# EAGLE design Croduino Nova v1.2 (EAGLE 7.3.0)

## Sheet 1 of 2
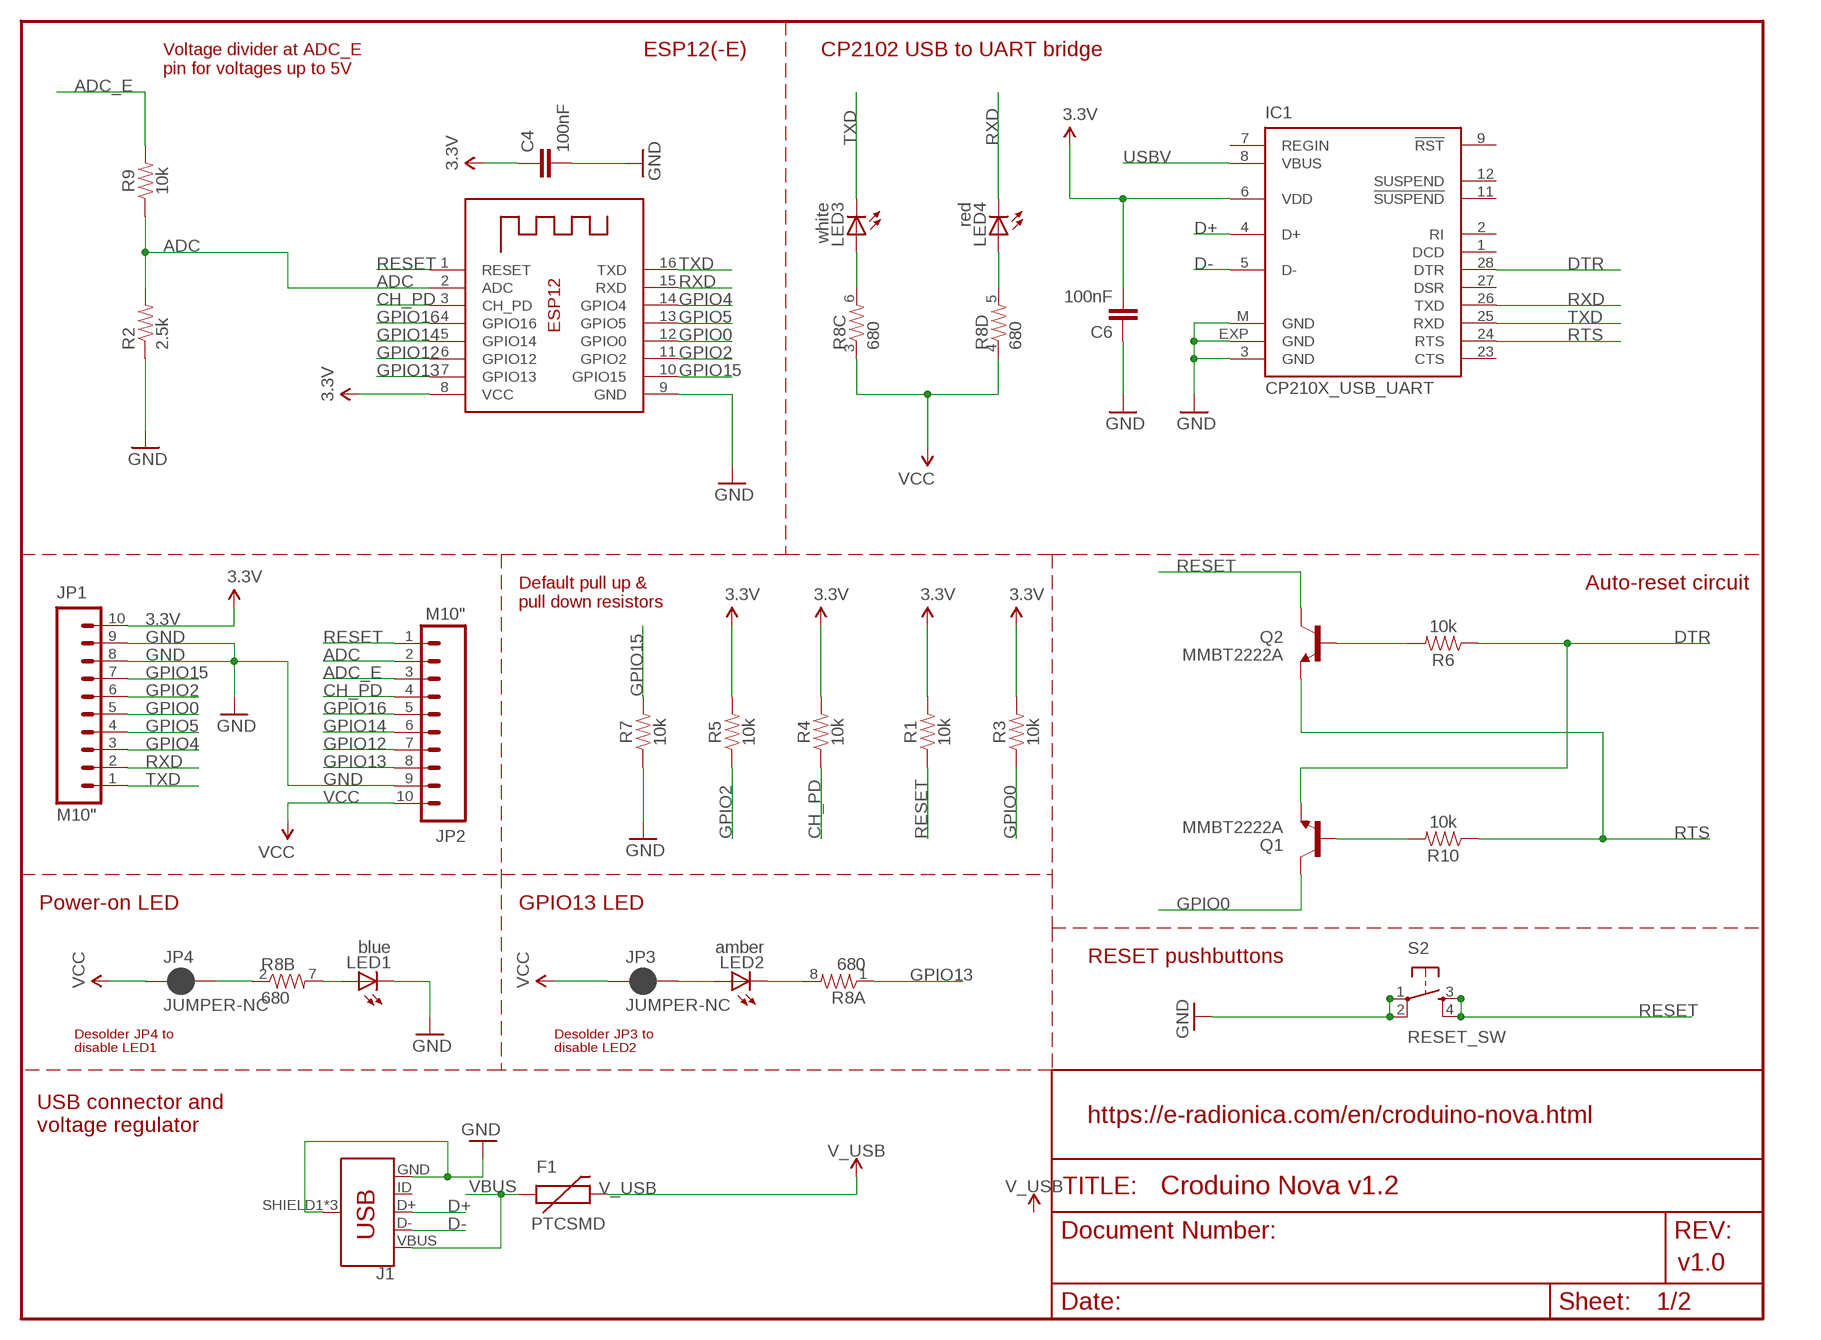
[diagram p0: schematic, sheet 1]

### Parts
C4  100nF  CAP0603-CAP  [0603-CAP]
C6  100nF  CAP0603-CAP  [0603-CAP]
F1  PTCSMD  [PTC-1206]
IC1  CP210X_USB_UART  [MLP28]
J1  USB_MICRO-BREDUCED_PASTE  [USB-B-MICRO-SMD_RED_PASTE]
JP1  M10"  [1X10]
JP2  M10"  [1X10]
JP3  JUMPER-NC  JUMPER-SMT_2_NC_PASTE_NO-SILK  [SMT-JUMPER_2_NC_PASTE_NO-SILK]
JP4  JUMPER-NC  JUMPER-SMT_2_NC_PASTE_NO-SILK  [SMT-JUMPER_2_NC_PASTE_NO-SILK]
LED1  blue  LEDCHIP-LED0805  [CHIP-LED0805]
LED2  amber  LEDCHIP-LED0805  [CHIP-LED0805]
LED3  white  LEDCHIP-LED0805  [CHIP-LED0805]
LED4  red  LEDCHIP-LED0805  [CHIP-LED0805]
Q1  MMBT2222A  TRANSISTOR_NPNSOT23-3  [SOT23-3]
Q2  MMBT2222A  TRANSISTOR_NPNSOT23-3  [SOT23-3]
R1  10k  10KOHM-0603-1/10W-1%  [0603]
R2  2.5k  RESISTOR0603-RES  [0603-RES]
R3  10k  10KOHM-0603-1/10W-1%  [0603]
R4  10k  10KOHM-0603-1/10W-1%  [0603]
R5  10k  10KOHM-0603-1/10W-1%  [0603]
R6  10k  10KOHM-0603-1/10W-1%  [0603]
R7  10k  10KOHM-0603-1/10W-1%  [0603]
R8  680  RESISTOR-ARRAY0603-ARV  [0603-ARV]
R9  10k  10KOHM-0603-1/10W-1%  [0603]
R10  10k  10KOHM-0603-1/10W-1%  [0603]
S2  RESET_SW  TAC_SWITCHSMD  [TACTILE_SWITCH_SMD]
X1  ESP8266-12  ESP-12  [ESP-12]

### Nets
3.3V: C4.1 C6.2 IC1.6(VDD) JP1.10 R1.2 R3.2 R4.2 R5.2 X1.8(VCC) ; also sheet 2
ADC: JP2.2 R2.2 R9.1 X1.2(ADC)
ADC_E: JP2.3 R9.2
CH_PD: JP2.4 R4.1 X1.3(CH_PD)
D+: IC1.4(D+) J1.D+
D-: IC1.5(D-) J1.D-
DTR: IC1.28(DTR) Q1.2(E) R6.1
GND: C4.2 C6.1 IC1.3(GND) IC1.EXP(GND) IC1.M(GND) J1.GND J1.SHIELD1(SHIELD) J1.SHIELD2(SHIELD) J1.SHIELD3(SHIELD) JP1.8 JP1.9 JP2.9 LED1.C R2.1 R7.1 S2.1 S2.2 X1.9(GND) ; also sheet 2
GPIO0: JP1.5 Q1.3(C) R3.1 X1.12(GPIO0)
GPIO2: JP1.6 R5.1 X1.11(GPIO2)
GPIO4: JP1.3 X1.14(GPIO4)
GPIO5: JP1.4 X1.13(GPIO5)
GPIO12: JP2.7 X1.6(GPIO12)
GPIO13: JP2.8 R8.1 X1.7(GPIO13)
GPIO14: JP2.6 X1.5(GPIO14)
GPIO15: JP1.7 R7.2 X1.10(GPIO15)
GPIO16: JP2.5 X1.4(GPIO16)
N$1: LED3.A R8.6
N$2: JP4.2 R8.2
N$3: LED1.A R8.7
N$4: LED4.A R8.5
N$5: LED2.C R8.8
N$6: JP3.2 LED2.A
N$8: Q1.1(B) R10.2
N$11: Q2.1(B) R6.2
RESET: JP2.1 Q2.3(C) R1.1 S2.3 S2.4 X1.1(RESET)
RTS: IC1.24(RTS) Q2.2(E) R10.1
RXD: IC1.26(TXD) JP1.2 LED4.C X1.15(RXD)
TXD: IC1.25(RXD) JP1.1 LED3.C X1.16(TXD)
USBV: IC1.8(VBUS)
V_USB: F1.2 ; also sheet 2
VBUS: F1.1 J1.VBUS
VCC: JP2.10 JP3.1 JP4.1 R8.3 R8.4 ; also sheet 2
Unconnected: IC1.1(DCD) IC1.2(RI) IC1.7(REGIN) IC1.9(!RST) IC1.11(!SUSPEND) IC1.12(SUSPEND) IC1.23(CTS) IC1.27(DSR) J1.ID

### Notes on the sheet
- ESP12(-E) | CP2102 USB to UART bridge
- Voltage divider at ADC_E
  pin for voltages up to 5V
- Auto-reset circuit
- Default pull up &
  pull down resistors
- Power-on LED | GPIO13 LED
- RESET pushbuttons
- Desolder JP4 to 
  disable LED1
- Desolder JP3 to
  disable LED2
- https://e-radionica.com/en/croduino-nova.html
- USB connector and 
  voltage regulator
- v1.0

## Sheet 2 of 2
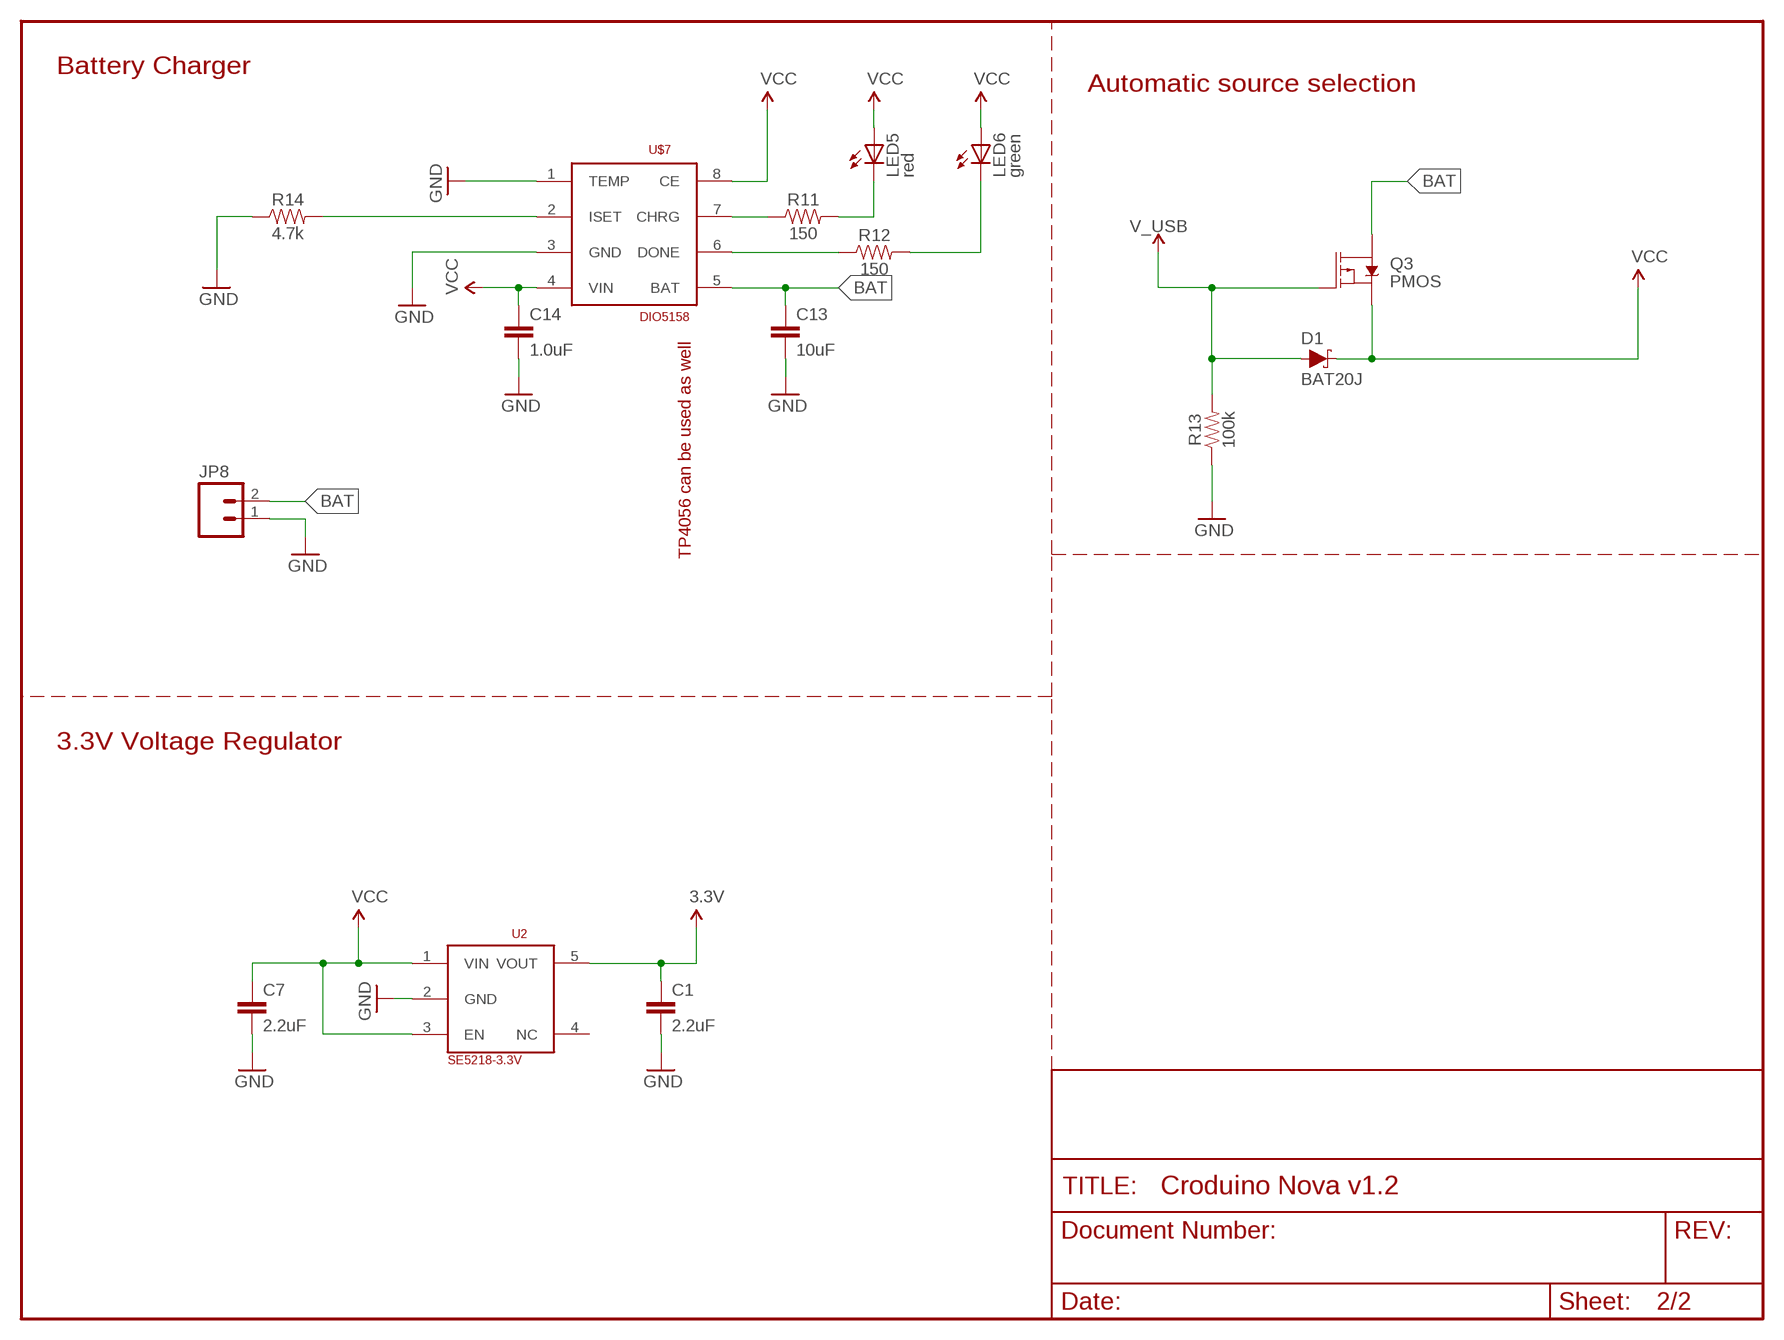
[diagram p1: schematic, sheet 2]

### Parts
C1  2.2uF  2.2UF-0603-10V-20%  [0603]
C7  2.2uF  2.2UF-0603-10V-20%  [0603]
C13  10uF  10UF-1206-6.3V-20%  [1206]
C14  1.0uF  1.0UF-0603-16V-10%  [0603]
D1  BAT20J  DIODE-SCHOTTKY-BAT20J  [SOD-323]
JP8  M02-JST-2MM-SMT  [JST-2-SMD]
LED5  red  LEDCHIP-LED0805  [CHIP-LED0805]
LED6  green  LEDCHIP-LED0805  [CHIP-LED0805]
Q3  PMOS  MOSFET_PCH-IRLML2244  [SOT23-3]
R11  150  150OHM-0603-1/10W-1%  [0603]
R12  150  150OHM-0603-1/10W-1%  [0603]
R13  100k  100KOHM-0603-1/10W-1%  [0603]
R14  4.7k  4.7KOHM-0603-1/10W-1%  [0603]
U2  SE5218-3.3V  SE5218  [SOT23-5]
U$7  DIO5158  [SOIC-8]

### Nets
3.3V: C1.1 U2.5(VOUT) ; also sheet 1
BAT: C13.1 JP8.2 Q3.3(D) U$7.5(BAT)
CHRG: R11.1 U$7.7(CHRG)
DONE: R12.1 U$7.6(DONE)
GND: C1.2 C7.2 C13.2 C14.2 JP8.1 R13.1 R14.1 U2.2(GND) U$7.1(TEMP) U$7.3(GND) ; also sheet 1
ISET: R14.2 U$7.2(ISET)
LED1: LED5.C R11.2
LED2: LED6.C R12.2
V_USB: D1.A Q3.1(G) R13.2 ; also sheet 1
VCC: C7.1 C14.1 D1.C LED5.A LED6.A Q3.2(S) U2.1(VIN) U2.3(EN) U$7.4(VIN) U$7.8(CE) ; also sheet 1
Unconnected: U2.4(NC)

### Notes on the sheet
- Battery Charger
- Automatic source selection
- TP4056 can be used as well
- 3.3V Voltage Regulator

## Library data of the parts
C1 C7 = SparkFun-Capacitors:2.2UF: 2.2µF ceramic capacitors A capacitor is a passive two-terminal electrical component used to store electrical energy temporarily in an electric field.; PROD_ID: CAP-07888
C4 C6 = SparkFun:CAP: Capacitor Standard 0603 ceramic capacitor, and 0.1" leaded capacitor.
C13 = SparkFun-Capacitors:10UF: 10.0µF ceramic capacitors A capacitor is a passive two-terminal electrical component used to store electrical energy temporarily in an electric field.; PROD_ID: CAP-10057
C14 = SparkFun-Capacitors:1.0UF: 1µF ceramic capacitors A capacitor is a passive two-terminal electrical component used to store electrical energy temporarily in an electric field.; PROD_ID: CAP-00868
D1 = SparkFun-DiscreteSemi:DIODE-SCHOTTKY: Schottky diode A Schottky diode is a semiconductor diode which has a low forward voltage drop and a very fast switching action.; PROD_ID: DIO-11623; VALUE: 1A/23V/620mV
F1 = SparkFun:PTC: Resettable Fuse PTC Resettable Fuse. Spark Fun Electronics SKU : COM-08357
IC1 = SparkFun:CP210X_USB_UART: Single-Chip USB to UART Bridge Source: www.silabs.com .. CP2101.pdf / cp2102.pdf. Spark Fun Electronics SKU : COM-00310
J1 = SparkFun-Connectors:USB_MICRO-B: USB Type Micro-B Connector Male/female and PTH/SMT variants SparkFun Products: SparkFun microB USB Breakout <https://www.sparkfun.com/products/12035> SparkFun USB microB Plug Breakout <https://www.sparkfun.com/products/10031> SparkFun ESP8266 Thing <https://www.sparkfun.com/products/13231>; PROD_ID: CONN-11752
JP1 JP2 = SparkFun:M10: Header 10 Standard 10-pin 0.1" header. Use with straight break away headers (SKU : PRT-00116), right angle break away headers (PRT-00553), swiss pins (PRT-00743), machine pins (PRT-00117), and female headers (PRT-00115).
JP3 JP4 = SparkFun-Jumpers:JUMPER-SMT_2_NC_PASTE: Normally closed solder jumper This jumper has an aperture in the stencil to allow solder paste to bridge the split in the wire so it's normally closed (NC). Wick off the solder to open the connection. Reapply solder to reclose the connection.
JP8 = SparkFun:M02: Header 2 Standard 2-pin 0.1" header. Use with straight break away headers (SKU : PRT-00116), right angle break away headers (PRT-00553), swiss pins (PRT-00743), machine pins (PRT-00117), and female headers (PRT-00115). Molex polarized connector foot print use with SKU : PRT-08233 with associated crimp pins and housings.
LED1-LED6 = adafruit:LED: LED OSRAM: - CHIPLED LG R971, LG N971, LY N971, LG Q971, LY Q971, LO R971, LY R971 LH N974, LH R974 LS Q976, LO Q976, LY Q976 LO Q996 - Hyper CHIPLED LW Q18S LB Q993, LB Q99A, LB R99A - SideLED LS A670, LO A670, LY A670, LG A670, LP A670 LB A673, LV A673, LT A673, LW A673 LH A674 LY A675 LS A676, LA A676, LO A676, LY A676, LW A676 LS A679, LY A679, LG A679 - Hyper Micro SIDELED® LS Y876, LA Y876, LO Y876, LY Y876 LT Y87S - SmartLED LW L88C, LW L88S LB L89C, LB L89S, LG L890 LS L89K, LO L89K, LY L89K LS L896, LA L896, LO L896, LY L896 - TOPLED LS T670, LO T670, LY T670, LG T670, LP T670 LSG T670, LSP T670, LSY T670, LOP T670, LYG T670 LG T671, LOG T671, LSG T671 LB T673, LV T673, LT T673, LW T673 LH T674 LS T676, LA T676, LO T676, LY T676, LB T676, LH T676, LSB T676, LW T676 LB T67C, LV T67C, LT T67C, LS T67K, LO T67K, LY T67K, LW E67C LS E67B, LA E67B, LO E67B, LY E67B, LB E67C, LV E67C, LT E67C LW T67C LS T679, LY T679, LG T679 LS T770, LO T770, LY T770, LG T770, LP T770 LB T773, LV T773, LT T773, LW T773 LH T774 LS E675, LA E675, LY E675, LS T675 LS T776, LA T776, LO T776, LY T776, LB T776 LHGB T686 LT T68C, LB T68C - Hyper Mini TOPLED® LB M676 - Mini TOPLED Santana® LG M470 LS M47K, LO M47K, LY M47K Source: http://www.osram.convergy.de/
Q1 Q2 = SparkFun:TRANSISTOR_NPN: Transistor NPN BJT configuration in SOT23 package. MMBT2222 is the common NPN we use. Double check BCE configuration again layout.
Q3 = SparkFun-DiscreteSemi:MOSFET_PCH: P-channel MOSFETs Voltage controlled devices that allow control of high current outputs. SparkFun Products: SparkFun ESP32 Thing <https://www.sparkfun.com/products/13907> SparkFun ESP8266 Thing <https://www.sparkfun.com/products/13231>; PROD_ID: TRANS-11153; VALUE: 4.3A/20V/54mΩ
R1 R3-R7 R9 R10 = SparkFun-Resistors:10KOHM: 10kΩ resistor A resistor is a passive two-terminal electrical component that implements electrical resistance as a circuit element. Resistors act to reduce current flow, and, at the same time, act to lower voltage levels within circuits. - Wikipedia; PROD_ID: RES-00824
R2 = SparkFun:RESISTOR: Resistor Basic schematic elements and footprints for 0603, 1206, and PTH resistors.
R8 = SparkFun:RESISTOR-ARRAY: Array Chip Resistor Source: RS Component / Phycomp
R11 R12 = SparkFun-Resistors:150OHM: 150Ω resistor A resistor is a passive two-terminal electrical component that implements electrical resistance as a circuit element. Resistors act to reduce current flow, and, at the same time, act to lower voltage levels within circuits. - Wikipedia; PROD_ID: RES-11028
R13 = SparkFun-Resistors:100KOHM: 100kΩ resistor A resistor is a passive two-terminal electrical component that implements electrical resistance as a circuit element. Resistors act to reduce current flow, and, at the same time, act to lower voltage levels within circuits. - Wikipedia; PROD_ID: RES-07828
R14 = SparkFun-Resistors:4.7KOHM: 4.7kΩ resistor A resistor is a passive two-terminal electrical component that implements electrical resistance as a circuit element. Resistors act to reduce current flow, and, at the same time, act to lower voltage levels within circuits. - Wikipedia; PROD_ID: RES-07857
S2 = SparkFun:TAC_SWITCH: Momentary Switch Button commonly used for reset or general input. Spark Fun Electronics SKU : COM-00097
U2 = ERADIONICA:SE5218
U$7 = ERADIONICA:DIO5158
X1 = adafruit:ESP-12

## Board
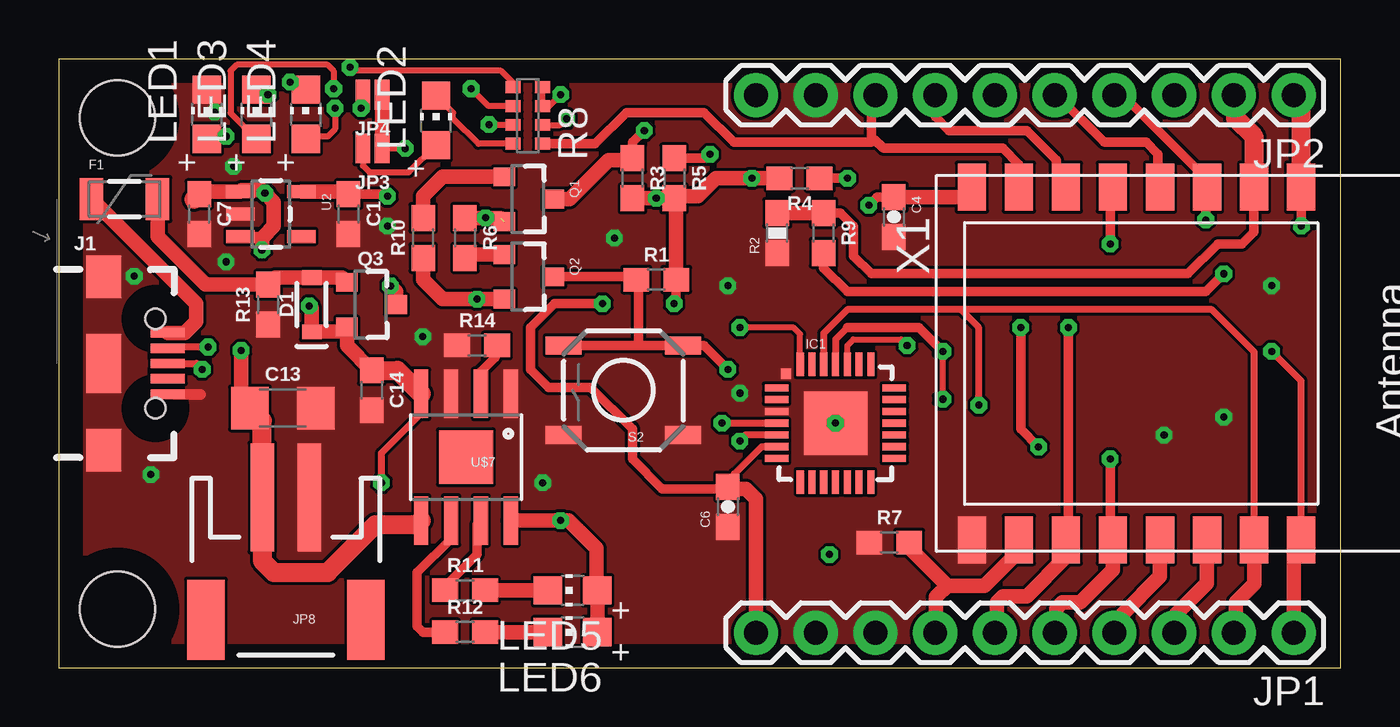
[diagram p2: board, top side]
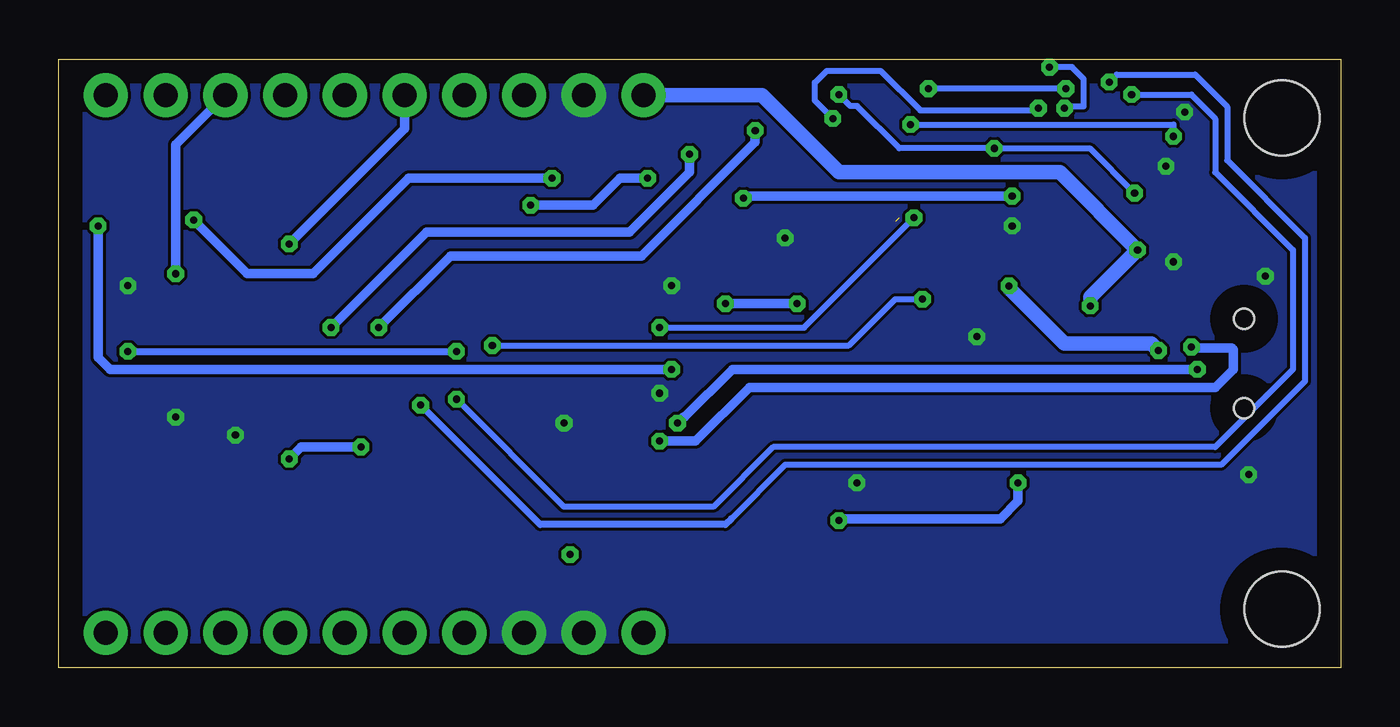
[diagram p3: board, bottom side, seen from below]

Size 54.5 x 25.9 mm. Coordinates in mm from the lower left corner, seen from the top.
Outline: 0,0 54.5,0 54.5,25.9 0,25.9 0,0
Copper layers (1*16): Top 0.035mm / dielectric 1.5mm / Bottom 0.035mm
Design rules "default *": minimum track width 10mil, minimum drill 24mil, track to track 5mil, track to pad 5mil, pad to pad 5mil, via to via 5mil, smd to smd 0mil, copper to edge 40mil, drill to drill 8mil, minimum pad ring 10mil, minimum via ring 8mil, stop-mask expansion 4mil, vias tented up to drill 0.6mm, thermal gap 10mil
Holes 3.2 mm at 2.5,23.4 2.5,2.5

### Footprints (pad centres in the part's own frame; a part is rotated, then mirrored left to right if it is on the bottom)
0603 = smd 1.1 x 1: 1 -0.85,0; 2 0.85,0
0603-CAP = smd 1.1 x 1: 1 -0.85,0; 2 0.85,0
1206 = smd 1.6 x 1.8: 1 -1.4,0; 2 1.4,0
SOD-323 = smd 0.63 x 0.83: A 1.15,0; C -1.15,0
PTC-1206 = smd 1 x 1.8: 1 -1.4,0; 2 1.4,0
MLP28 = smd 1 x 0.3: 1 -2.5,1.5; 2 -2.5,1; 3 -2.5,0.5; 4 -2.5,0; 5 -2.5,-0.5; 6 -2.5,-1; 7 -2.5,-1.5; 15 2.5,-1.5; 16 2.5,-1; 17 2.5,-0.5; 18 2.5,0; 19 2.5,0.5; 20 2.5,1; 21 2.5,1.5 | smd 0.3 x 1: 8 -1.5,-2.5; 9 -1,-2.5; 10 -0.5,-2.5; 11 0,-2.5; 12 0.5,-2.5; 13 1,-2.5; 14 1.5,-2.5; 22 1.5,2.5; 23 1,2.5; 24 0.5,2.5; 25 0,2.5; 26 -0.5,2.5; 27 -1,2.5; 28 -1.5,2.5 | smd 2.7 x 2.7: EXP 0,0 | smd 0.435 x 0.435: M -2.103,2.103
USB-B-MICRO-SMD_RED_PASTE = smd 1.45 x 0.4: D+ 2.725,0; D- 2.725,0.65; GND 2.725,-1.3; ID 2.725,-0.65; VBUS 2.725,1.3 | smd 1.5 x 1.8: SHIELD1 0,3.685; SHIELD2 0,-3.685 | smd 1.5 x 2.5: SHIELD3 0,0 | hole 0.85: 2.2,1.9; 2.2,-1.9
1X10 = drill 1.016 pad 1.88: 1 0,0; 2 2.54,0; 3 5.08,0; 4 7.62,0; 5 10.16,0; 6 12.7,0; 7 15.24,0; 8 17.78,0; 9 20.32,0; 10 22.86,0
SMT-JUMPER_2_NC_PASTE_NO-SILK = smd 0.635 x 1.27: 1 -0.406,0; 2 0.406,0
JST-2-SMD = smd 1 x 4.6: 1 -1,-3.7; 2 1,-3.7 | smd 1.6 x 3.4: NC1 -3.4,1.5; NC2 3.4,1.5
CHIP-LED0805 = smd 1.2 x 1.2: A 0,-1.05; C 0,1.05
SOT23-3 = smd 0.8 x 0.9: 1 -0.95,-1; 2 0.95,-1; 3 0,1.1
0603-RES = smd 1.1 x 1: 1 -0.85,0; 2 0.85,0
0603-ARV = smd 0.5 x 0.65: 1 -1.2,-0.625; 2 -0.4,-0.625; 3 0.4,-0.625; 4 1.2,-0.625; 5 1.2,0.625; 6 0.4,0.625; 7 -0.4,0.625; 8 -1.2,0.625
TACTILE_SWITCH_SMD = smd 1.524 x 0.762: 1 -2.54,1.905; 2 2.54,1.905; 3 -2.54,-1.905; 4 2.54,-1.905
SOT23-5 = smd 0.55 x 1.2: 1 -0.95,-1.3; 2 0,-1.3; 3 0.95,-1.3; 4 0.95,1.3; 5 -0.95,1.3
SOIC-8 = smd 0.61 x 2.057: 1 -2.07,-2.892; 2 -0.8,-2.892; 3 0.47,-2.892; 4 1.74,-2.892; 5 1.74,2.492; 6 0.47,2.492; 7 -0.8,2.492; 8 -2.07,2.492 | smd 2.286 x 2.286: EPAD -0.165,-0.2
ESP-12 = smd 2 x 1.2: 1 -7.5,4.5; 2 -7.5,2.5; 3 -7.5,0.5; 4 -7.5,-1.5; 5 -7.5,-3.5; 6 -7.5,-5.5; 7 -7.5,-7.5; 8 -7.5,-9.5; 9 7.5,-9.5; 10 7.5,-7.5; 11 7.5,-5.5; 12 7.5,-3.5; 13 7.5,-1.5; 14 7.5,0.5; 15 7.5,2.5; 16 7.5,4.5

### Placement (x,y rotation side)
C1  12.32,19.3 270 top
C4  35.5,19.18 270 top
C6  28.45,6.86 90 top
C7  5.97,19.3 270 top
C13  9.53,11.05 0 top
C14  13.3,11.81 270 top
D1  10.75,15.45 90 top
F1  2.79,19.94 0 top
IC1  33.02,10.41 0 top
J1  1.91,12.95 0 top
JP1  52.5,1.5 180 top
JP2  52.5,24.36 180 top
JP3  13.34,22.1 180 top
JP4  13.34,24.38 180 top
JP8  9.65,3.56 180 top
LED1  6.3,23.55 0 top
LED2  16.04,23.29 0 top
LED3  8.4,23.55 0 top
LED4  10.5,23.55 0 top
LED5  21.84,3.3 90 top
LED6  21.84,1.52 90 top
Q1  19.94,19.94 270 top
Q2  19.94,16.64 270 top
Q3  13.25,15.45 270 top
R1  25.4,16.51 0 top
R2  30.54,18.5 90 top
R3  24.38,20.83 270 top
R4  31.5,20.83 180 top
R5  26.16,20.83 270 top
R6  17.27,18.29 270 top
R7  35.31,5.33 0 top
R8  19.94,23.5 90 top
R9  32.51,18.5 270 top
R10  15.49,18.29 90 top
R11  17.27,3.3 0 top
R12  17.27,1.52 0 top
R13  8.9,15.45 90 top
R14  17.78,13.72 0 top
S2  24,11.81 180 top
U2  9.02,19.3 270 top
U$1  [LOGO-3MM]  22.61,5.94 0 top
U$2  [CRODUINO_NOVA]  4.06,1.02 0 top
U$3  [OSH-3MM]  1.09,4.88 0 top
U$4  [E-R.IO-6MM]  21.27,4.25 0 top
U$5  [MADE-IN-CROATIA-10MM]  38.61,7.11 0 top
U$6  [E-R.IO-BACK-6MM]  0.85,16.25 270 top
U$7  17.14,8.76 180 top
X1  48.32,12.95 270 top

### Tracks (layer width: path | path; a pad name or v marks a point on that pad's centre or on a via)
3.3V  (via drill 0.3)
  Top 0.305: IC1.6 29.88,9.41 28.73,8.25 28.73,7.99 C6.2
  Top 0.406: C1.1 13.88,20.15 v13.97,20.07 | C4.1 34.79,20.03 v34.44,19.68 | R1.2 26.25,15.58 v26.16,15.49 | v23.11,15.49 21.08,15.49 20.07,14.48 20.07,12.7 20.83,11.94 22.61,11.94 24.38,10.16 24.38,8.89 25.65,7.62 28.36,7.62 C6.2
  Top 0.61: U2.5 12.22,20.25 C1.1 | R3.2 v25.4,19.98 R5.2 | R1.2 26.25,19.89 R5.2 | R4.2 v29.46,20.83 27.94,20.83 27.18,20.07 26.25,20.07 R5.2 | C4.1 38.4,20.03 X1.8 | JP1.10 29.64,7.19 29.21,7.62 28.54,7.62 C6.2
  Bottom 0.406: v13.97,20.07 25.31,20.07 v25.4,19.98 | v34.44,19.68 31.8,19.68 R4.2 v29.46,20.83 | v26.16,15.49 v23.11,15.49
ADC
  Top 0.406: R9.1 33.23,19.35 33.78,18.8 33.78,17.53 34.54,16.76 48.01,16.76 49.28,18.03 50.29,18.03 50.8,18.54 50.8,20.43 X1.2
  Top 0.61: R2.2 R9.1
  Top 0.813: X1.2 50.82,22.59 50.04,23.37 50.04,24.28 JP2.2
ADC_E  (via drill 0.3)
  Top 0.406: R9.2 32.51,17.02 33.53,16 48.77,16 v49.53,16.76
  Bottom 0.406: v49.53,16.76 49.53,22.25 JP2.3
BAT  (via drill 0.3)
  Top 0.61: Q3.3 14.35,16 v14.1,16.25 | v7.75,13.5 7.75,11.42 C13.1
  Top 0.813: 7.75,11.42 C13.1 8.65,10.52 JP8.2 8.65,4.56 9.14,4.06 11.43,4.06 13.46,6.1 15.23,6.1 U$7.5
  Bottom 0.61: v14.1,16.25 14.1,16.15 11.75,13.8 8.05,13.8 v7.75,13.5
CH_PD  (via drill 0.3)
  Top 0.406: JP2.4 45.24,24.36 48.51,21.08 48.51,20.75 X1.3 48.77,20.4 v48.77,19.05 | R4.1 v33.53,20.83
  Bottom 0.406: v33.53,20.83 39.62,20.83 43.69,16.76 46.48,16.76 v48.77,19.05
CHRG
  Top 0.406: R11.1 16.42,3.47 17.78,4.83 17.78,6.11 U$7.7
D+  (via drill 0.3)
  Top 0.305: J1.D+ 5.85,12.95 v6.1,12.7 | v28.19,10.41 IC1.4
  Bottom 0.305: 27.94,10.67 v28.19,10.41
  Bottom 0.406: 27.94,10.67 27.9,10.67 25.87,12.7 v6.1,12.7
D-  (via drill 0.3)
  Top 0.305: IC1.5 29.21,9.91 v28.96,9.65 | v6.35,13.65 4.68,13.65 J1.D-
  Bottom 0.305: 5.33,13.65 v6.35,13.65
  Bottom 0.406: v28.96,9.65 27.43,9.65 25.15,11.94 5.33,11.94 4.57,12.7 4.57,13.54 J1.D- 6.3,13.6 v6.35,13.65
DONE
  Top 0.406: U$7.6 16.68,5.5 15.24,4.06 15.24,1.78 15.49,1.52 R12.1
DTR  (via drill 0.3)  (1 unrouted)
  Top 0.254: IC1.28 31.52,14.2 31.24,14.48 v28.96,14.48 | v18.14,19.15 17.93,18.99 17.78,19.14
  Top 0.61: R6.1 17.78,19.14 18.79,19.14 v18.14,19.15
  Bottom 0.254: v28.96,14.48 22.82,14.48 v18.14,19.15
GND  (via drill 0.3)
  Top 0.254: 4.92,11.64 J1.GND
  Top 0.45: 6.03,11.64 4.92,11.64
  other vias: 15.47,14.09 3.21,16.66 20.57,7.87 46.99,9.91 49.53,10.67 51.56,16.26 28.45,16.26 23.62,18.29 13.97,18.8 33.02,10.41 28.96,11.68 7.11,17.27 7.43,21.34 6.63,23.65 3.91,8.22
  pour Bottom (no thermals): 0,0 54.5,0 53.5,25.9 0,25.9
  pour Top (no thermals): 0,0 54.5,0 54.5,25.9 0,25.9
GPIO0  (via drill 0.3)
  Top 0.406: R3.1 24.38,22.35 v24.89,22.86 | v40.89,14.48 40.89,10.16 v41.66,9.4 | v44.7,8.89 44.7,5.56 X1.12
  Top 0.61: X1.12 44.82,4.18 43.43,2.79 42.67,2.79 42.42,2.54 42.42,1.58 JP1.5 | Q1.3 21.72,19.94 23.37,21.59 24.3,21.59 R3.1
  Bottom 0.406: v24.89,22.86 24.89,22.35 29.72,17.53 37.85,17.53 v40.89,14.48 | v41.66,9.4 44.2,9.4 v44.7,8.89
GPIO2  (via drill 0.3)
  Top 0.406: R5.1 27.52,21.68 v27.69,21.84 | v42.93,14.48 42.93,5.56 X1.11
  Top 0.61: X1.11 42.82,4.72 41.15,3.05 40.13,3.05 39.88,2.79 39.88,1.58 JP1.6
  Bottom 0.406: v27.69,21.84 27.69,21.08 30.23,18.54 38.86,18.54 v42.93,14.48
GPIO4
  Top 0.61: X1.14 48.82,3.61 47.5,2.29 47.5,1.58 JP1.3
GPIO5
  Top 0.61: X1.13 46.82,3.89 45.21,2.29 45.21,1.83 JP1.4
GPIO12
  Top 0.406: JP2.7 37.26,23.45 37.85,22.86 41.15,22.86 42.42,21.59 42.42,20.85 X1.6
GPIO13
  Top 0.406: X1.7 40.82,21.41 40.13,22.1 35.05,22.1 34.67,22.48 | 34.67,22.48 34.54,22.61 34.54,24.18 JP2.8 | R8.1 22.8,22.3 24.13,23.62 27.43,23.62 28.7,22.35 34.54,22.35 34.67,22.48
GPIO14  (via drill 0.3)
  Top 0.406: v44.7,18.03 44.7,20.34 X1.5
  Bottom 0.406: JP2.6 39.8,22.94 v44.7,18.03
GPIO15
  Top 0.61: X1.10 40.82,4.95 39.36,3.49 37.77,3.49 | 37.77,3.49 37.29,3.02 37.29,1.53 JP1.7 | R7.2 36.16,5.11 37.77,3.49
GPIO16
  Top 0.406: JP2.5 42.44,24.36 44.45,22.35 46.23,22.35 46.74,21.84 46.74,20.53 X1.4
ISET
  Top 0.406: U$7.2 17.95,12.61 18.54,13.21 18.54,13.63 R14.2
LED1
  Top 0.61: LED5.C R11.2
LED2
  Top 0.61: R12.2 LED6.C
N$1  (via drill 0.3)
  Top 0.254: R8.6 18.27,23.89 v17.53,24.64 | v11.68,24.64 11.68,25.4 11.43,25.65 7.56,25.65 7.3,25.39 7.3,23.6 LED3.A
  Bottom 0.254: v11.68,24.64 v17.53,24.64
N$2  (via drill 0.3)
  Top 0.254: R8.2 21.32,23.09 v21.59,23.37 | v12.86,23.8 12.86,24.31 JP4.2
  Bottom 0.254: v21.59,23.37 22.35,24.13 22.35,24.89 21.84,25.4 19.56,25.4 17.88,23.72 12.93,23.72 v12.86,23.8
N$3  (via drill 0.3)
  Top 0.254: R8.7 18.31,23.09 v18.29,23.11 | 6.19,22.61 LED1.A 6.41,22.61 v7.11,22.61
  Bottom 0.254: v18.29,23.11 7.11,23.11 v7.11,22.61
N$4  (via drill 0.3)
  Top 0.254: R8.5 19.31,24.88 18.8,25.4 12.53,25.4 v12.38,25.55 | v11.74,23.8 11.74,22.92 11.43,22.61 10.61,22.61 LED4.A
  Bottom 0.254: v12.38,25.55 11.43,25.55 10.92,25.05 10.92,23.88 11.67,23.88 v11.74,23.8
N$5
  Top 0.254: R8.8 17.84,22.3 16.76,23.37 16.76,23.61 LED2.C
N$6
  Top 0.254: JP3.2 12.93,21.36 13.21,21.08 14.88,21.08 LED2.A
N$8
  Top 0.61: Q1.1 16.32,20.89 15.49,20.07 R10.2
N$11
  Top 0.61: Q2.1 17.42,17.59 R6.2
N$14  (via drill 0.3)
  other vias: 32.77,4.83
RESET  (via drill 0.3)
  Top 0.406: S2.4 24.64,13.72 | 24.64,13.72 S2.3 27.43,13.72 v28.45,12.7 | R1.1 24.42,16.64 Q2.3 24.51,16.64 24.64,16.51 24.64,13.72 | v52.83,18.8 52.83,20.44 X1.1
  Top 0.813: X1.1 52.82,24.04 JP2.1
  Bottom 0.406: v28.45,12.7 52.32,12.7 52.83,13.21 v52.83,18.8
RTS  (via drill 0.3)
  Top 0.254: IC1.24 33.52,13.71 33.78,13.97 35.81,13.97 v36.07,13.72
  Top 0.61: Q2.2 v17.78,15.69 16.32,15.69 16.13,15.88 15.49,16.51 R10.1
  Bottom 0.254: v36.07,13.72 20.91,13.72 Q2.2 v17.78,15.69
RXD  (via drill 0.3)
  Top 0.254: LED4.C 10.16,24.6 v9.84,24.92
  Top 0.305: X1.15 50.82,13.44 49.02,15.24 38.35,15.24 | 38.35,15.24 33.53,15.24 32.51,14.22 IC1.26 | v39.12,11.18 39.12,14.48 38.35,15.24
  Top 0.61: X1.15 50.82,3.57 50.04,2.79 50.04,1.58 JP1.2
  Bottom 0.254: v9.84,24.92 9.52,25.23 6.18,25.23 4.83,23.88 4.83,21.59 1.52,18.29 1.52,12.19 5.08,8.64 23.62,8.64 25.91,6.35
  Bottom 0.305: 25.91,6.35 26.16,6.1 34.04,6.1 v39.12,11.18
TXD  (via drill 0.3)
  Top 0.254: LED3.C 8.93,24.6 v8.89,24.38 | v37.59,11.43 v37.59,13.46
  Top 0.305: X1.16 52.82,12.21 v51.56,13.46 | IC1.25 33.02,13.97 33.53,14.48
  Top 0.406: 33.53,14.48 36.58,14.48 v37.59,13.46
  Top 0.61: JP1.1 52.5,5.13 X1.16
  Bottom 0.254: v8.89,24.38 6.35,24.38 5.33,23.37 5.33,21.08 2.03,17.78 2.03,12.7 5.33,9.4 24.13,9.4 26.67,6.86 33.02,6.86 v37.59,11.43
  Bottom 0.305: v51.56,13.46 v37.59,13.46
V_USB
  Top 0.61: Q3.1 12.05,16.6 D1.A 9.2,16.6 R13.2 6.25,16.3 4.19,18.36 F1.2
VBUS
  Top 0.61: J1.VBUS 5.36,14.25 5.84,14.73 5.84,15.49 F1.1
VCC  (via drill 0.3)
  Top 0.254: R8.4 R8.3 20.58,23.88 20.83,23.88 v21.34,24.38 | JP3.1 v14.73,22.1
  Top 0.305: v13.72,7.87 13.72,9.14 15.4,10.83
  Top 0.406: U2.3 8.7,18.35 | 7.78,20.32 U2.1 | U$7.4 15.4,10.83
  Top 0.61: LED6.A LED5.A 22.86,3.34 22.86,5.08 21.67,6.27 v21.34,6.27 U$7.8 | U2.1 6.07,20.25 C7.1 | 7.78,20.32 8.64,20.32 v8.76,20.19 9.14,19.81 9.14,18.8 8.7,18.35 8.64,18.29 v8.64,17.78 | JP4.1 JP3.1 | C14.1 12.25,13.71 Q3.2 12.05,14.3 D1.C 10.75,15.3 v10.65,15.4
  Top 0.813: C14.1 14.4,12.66 U$7.4 | 5.75,19.94 C7.1
  Bottom 0.254: v8.76,20.19 10.67,22.1 v14.73,22.1 18.77,22.1 R8.3 20.85,23.89 v21.34,24.38
  Bottom 0.406: v13.72,7.87 13.72,7.11 14.48,6.35 21.26,6.35 v21.34,6.27
  Bottom 0.61: JP2.10 24.61,24.36 21.34,21.08 11.94,21.08 v8.64,17.78 10.65,15.77 v10.65,15.4

### Text on the board
200bmp: VIN | 5V | gnd | 13 | 12 | 14 | 16 | EN | A_e | A | rst | pwr | tx | rx | 13 | v1.2, REV A | RESET | Croduino Nova / e-radionica.com / Nov 2017 | v1.2., REV A | ESP12-E | gnd | gnd | 15 | 2 | 0 | 5 | 4 | 3 | 1 | CHRG | 3V3 | rx | tx | DONE